# EAGLE design Loco-Speedometer (EAGLE 9.7.0)

## Sheet 1 of 2
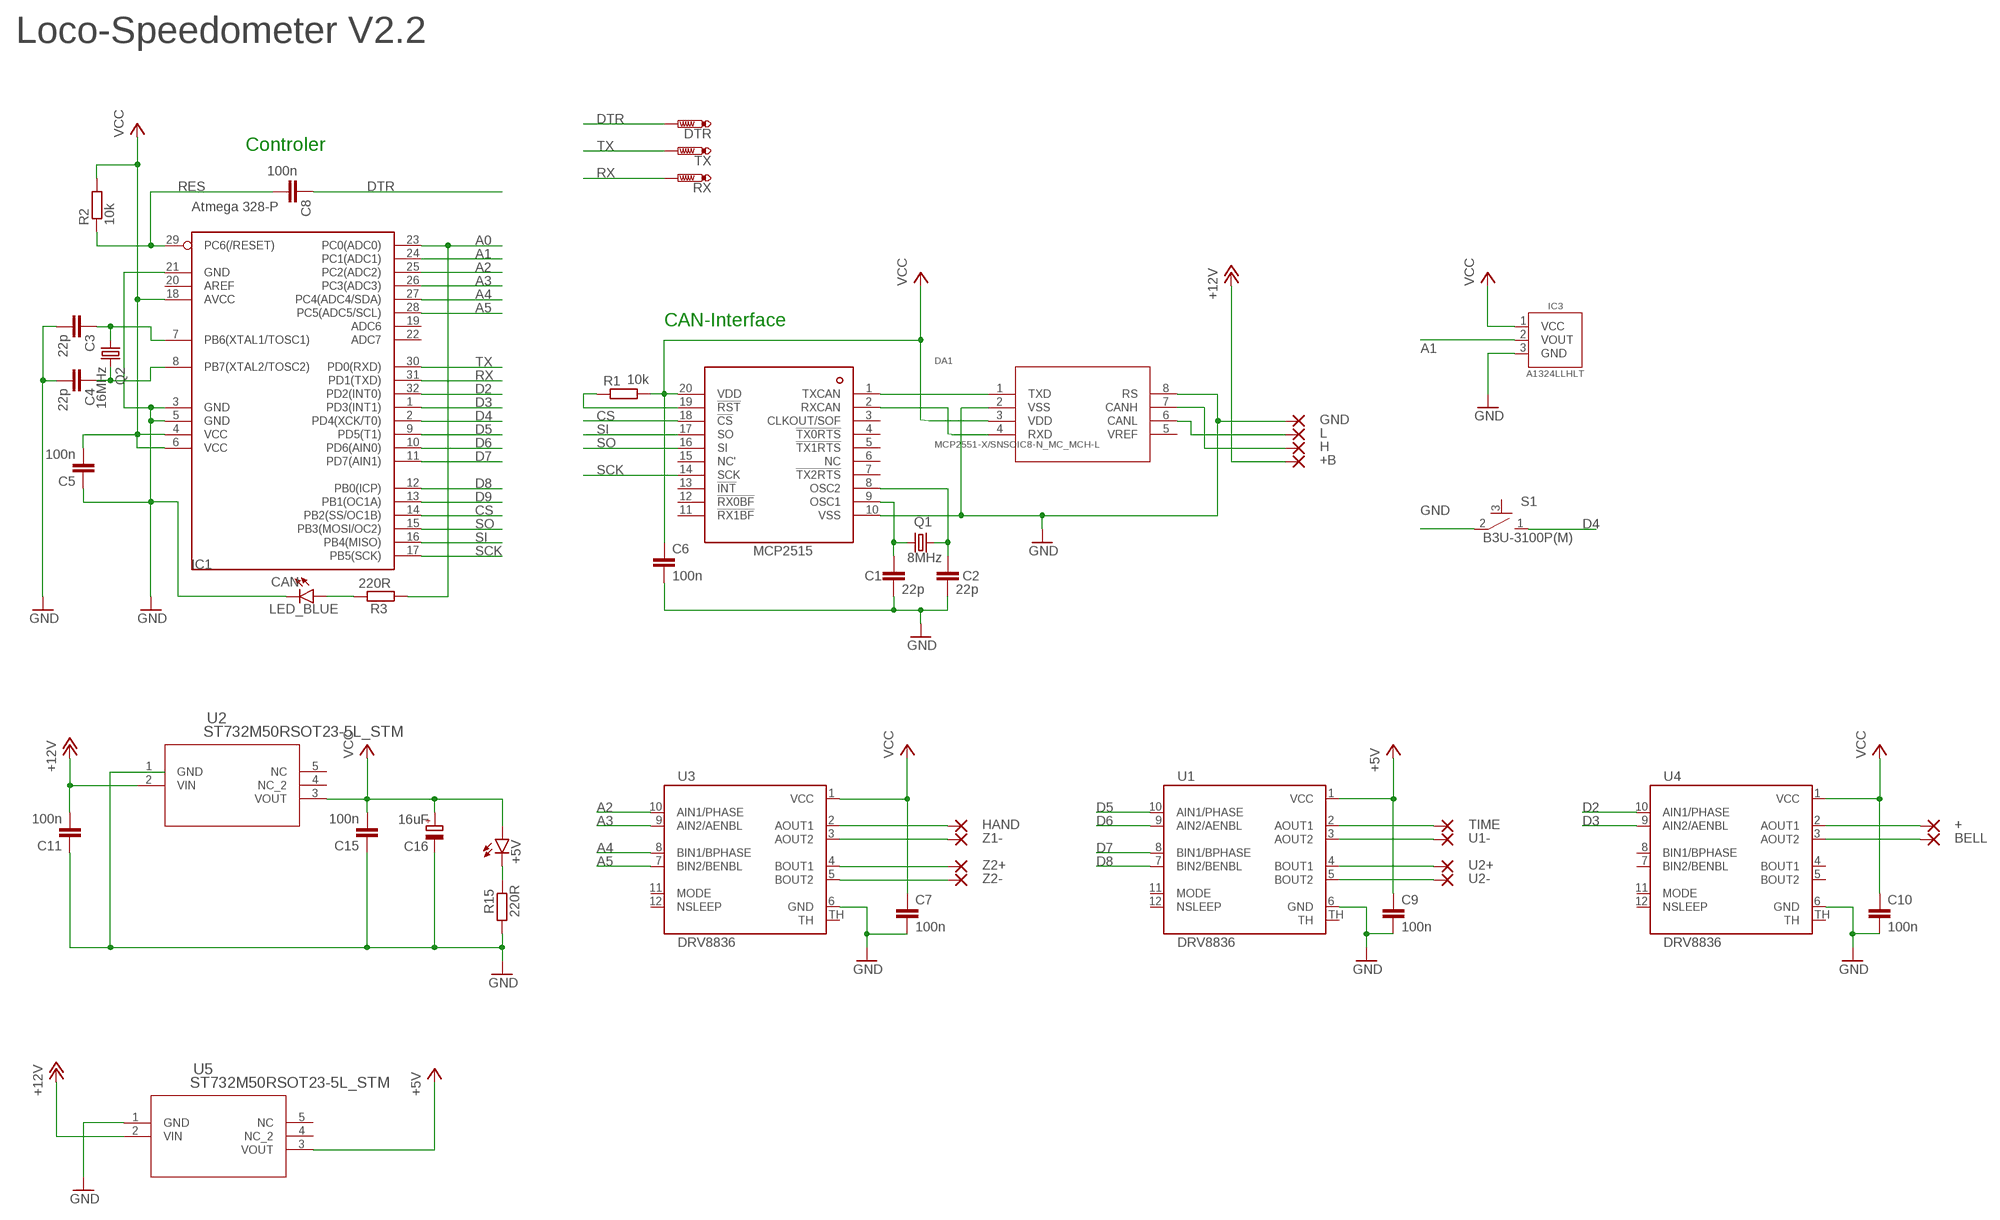
[diagram p0: schematic, sheet 1]

### Parts
+  SMD1  [SMD1,27-1,90]
+5V  LEDCHIP-LED0603  [CHIP-LED0603]
+B  SMD1  [SMD1,27-1,90]
BELL  SMD1  [SMD1,27-1,90]
C1  22p  C-EUC0402K  [C0402K]
C2  22p  C-EUC0402K  [C0402K]
C3  22p  C-EUC0402K  [C0402K]
C4  22p  C-EUC0402K  [C0402K]
C5  100n  C-EUC0402K  [C0402K]
C6  100n  C-EUC0402K  [C0402K]
C7  100n  C-EUC0402K  [C0402K]
C8  100n  C-EUC0402K  [C0402K]
C9  100n  C-EUC0402K  [C0402K]
C10  100n  C-EUC0402K  [C0402K]
C11  100n  C-EUC0402K  [C0402K]
C15  100n  C-EUC0402K  [C0402K]
C16  16uF  CPOL-EUA/3216-18W  [A/3216-18W]
CAN  LED_BLUE  LED_CHIP_BLUE-1608  [LEDC1608X39N_B]
DA1  MCP2551-X/SNSOIC8-N_MC_MCH-L  [SOIC8-N_MC_MCH-L]
DTR  PTR1B1,27  [B1,27]
GND  SMD1  [SMD1,27-1,90]
H  SMD1  [SMD1,27-1,90]
HAND  SMD1  [SMD1,27-1,90]
IC1  Atmega 328-P  MEGA8  [TQFP32-08]
IC2  MCP2515  [TSSOP20]
IC3  A1324LLHLT  A1324LLHLT-TLH  [SOT95P285X113-3N]
L  SMD1  [SMD1,27-1,90]
Q1  8MHz  KX-9B  [5.0X3.2_2]
Q2  16MHz  KX-9B  [5.0X3.2_2]
R1  10k  R-EU_R0402  [R0402]
R2  10k  R-EU_R0402  [R0402]
R3  220R  R-EU_R0402  [R0402]
R15  220R  R-EU_R0402  [R0402]
RX  PTR1B1,27  [B1,27]
S1  B3U-3100P(M)  B3U-X100B3U-3100P(M)3100P(M)  [B3U-3100P(M)]
TIME  SMD1  [SMD1,27-1,90]
TX  PTR1B1,27  [B1,27]
U1  DRV8836  [12WSON]
U1-  SMD1  [SMD1,27-1,90]
U2  ST732M50RSOT23-5L_STM  [SOT23-5L_STM]
U2+  SMD1  [SMD1,27-1,90]
U2-  SMD1  [SMD1,27-1,90]
U3  DRV8836  [12WSON]
U4  DRV8836  [12WSON]
U5  ST732M50RSOT23-5L_STM  [SOT23-5L_STM]
Z1-  SMD1  [SMD1,27-1,90]
Z2+  SMD1  [SMD1,27-1,90]
Z2-  SMD1  [SMD1,27-1,90]

### Nets
+5V: C9.1 U1.1(VCC) U5.3(VOUT)
+12V: +B.1(P) C11.2 U2.2(VIN) U5.2(VIN)
A0: IC1.23(PC0(ADC0)) R3.1
A1: IC1.24(PC1(ADC1)) IC3.2(VOUT)
A2: IC1.25(PC2(ADC2)) U3.10(AIN1/PHASE)
A3: IC1.26(PC3(ADC3)) U3.9(AIN2/AENBL)
A4: IC1.27(PC4(ADC4/SDA)) U3.8(BIN1/BPHASE)
A5: IC1.28(PC5(ADC5/SCL)) U3.7(BIN2/BENBL)
CAN-H: DA1.7(CANH) H.1(P)
CAN-L: DA1.6(CANL) L.1(P)
CAN-OCC1: C1.1 IC2.9(OSC1) Q1.1
CAN-OCC2: C2.1 IC2.8(OSC2) Q1.2
CS: IC1.14(PB2(SS/OC1B)) IC2.18(!CS)
D2: IC1.32(PD2(INT0)) U4.10(AIN1/PHASE)
D3: IC1.1(PD3(INT1)) U4.9(AIN2/AENBL)
D4: IC1.2(PD4(XCK/T0)) S1.1
D5: IC1.9(PD5(T1)) U1.10(AIN1/PHASE)
D6: IC1.10(PD6(AIN0)) U1.9(AIN2/AENBL)
D7: IC1.11(PD7(AIN1)) U1.8(BIN1/BPHASE)
D8: IC1.12(PB0(ICP)) U1.7(BIN2/BENBL)
D9: IC1.13(PB1(OC1A))
DTR: C8.1 DTR.TP
GND: C1.2 C2.2 C3.2 C4.2 C5.1 C6.2 C7.2 C9.2 C10.2 C11.1 C15.1 C16.- CAN.1(C) DA1.2(VSS) DA1.8(RS) GND.1(P) IC1.3(GND) IC1.5(GND) IC1.21(GND) IC2.10(VSS) IC3.3(GND) R15.1 S1.2 U1.6(GND) U2.1(GND) U3.6(GND) U4.6(GND) U5.1(GND)
N$3: CAN.2(A) R3.2
N$6: IC2.19(!RST) R1.1
N$9: C7.1 U3.1(VCC) ; supply symbol labelled VCC
N$10: C3.1 IC1.7(PB6(XTAL1/TOSC1)) Q2.1
N$11: C4.1 IC1.8(PB7(XTAL2/TOSC2)) Q2.2
N$12: +5V.C R15.2
RES: C8.2 IC1.29(PC6(/RESET)) R2.1
RX: IC1.31(PD1(TXD)) RX.TP
RXCAN: DA1.4(RXD) IC2.2(RXCAN)
SCK: IC1.17(PB5(SCK)) IC2.14(SCK)
SI: IC1.16(PB4(MISO)) IC2.17(SO)
SO: IC1.15(PB3(MOSI/OC2)) IC2.16(SI)
TX: IC1.30(PD0(RXD)) TX.TP
TXCAN: DA1.1(TXD) IC2.1(TXCAN)
U1+: TIME.1(P) U1.2(AOUT1)
U1+1: +.1(P) U4.2(AOUT1)
U1-: U1-.1(P) U1.3(AOUT2)
U1-1: BELL.1(P) U4.3(AOUT2)
U2+: U1.4(BOUT1) U2+.1(P)
U2-: U1.5(BOUT2) U2-.1(P)
VCC: +5V.A C5.2 C6.1 C10.1 C15.2 C16.+ DA1.3(VDD) IC1.4(VCC) IC1.6(VCC) IC1.18(AVCC) IC2.20(VDD) IC3.1(VCC) R1.2 R2.2 U2.3(VOUT) U4.1(VCC)
Z1+: HAND.1(P) U3.2(AOUT1)
Z1-: U3.3(AOUT2) Z1-.1(P)
Z2+: U3.4(BOUT1) Z2+.1(P)
Z2-: U3.5(BOUT2) Z2-.1(P)
Unconnected: DA1.5(VREF) IC1.19(ADC6) IC1.20(AREF) IC1.22(ADC7) IC2.3(CLKOUT/SOF) IC2.4(!TX0RTS) IC2.5(!TX1RTS) IC2.6(NC) IC2.7(!TX2RTS) IC2.11(!RX1BF) IC2.12(!RX0BF) IC2.13(!INT) IC2.15(NC') S1.3 U1.11(MODE) U1.12(NSLEEP) U1.TH U2.4(NC_2) U2.5(NC) U3.11(MODE) U3.12(NSLEEP) U3.TH U4.4(BOUT1) U4.5(BOUT2) U4.7(BIN2/BENBL) U4.8(BIN1/BPHASE) U4.11(MODE) U4.12(NSLEEP) U4.TH U5.4(NC_2) U5.5(NC)

### Notes on the sheet
- Loco-Speedometer V2.2
- Controler
- CAN-Interface

## Sheet 2 of 2

## Library data of the parts
+ +B BELL GND H HAND L TIME U1- U2+ U2- Z1- Z2+ Z2- = wirepad:SMD1: SMD PAD
+5V = led:LED: LED OSRAM: - CHIPLED LG R971, LG N971, LY N971, LG Q971, LY Q971, LO R971, LY R971 LH N974, LH R974 LS Q976, LO Q976, LY Q976 LO Q996 - Hyper CHIPLED LW Q18S LB Q993, LB Q99A, LB R99A - SideLED LS A670, LO A670, LY A670, LG A670, LP A670 LB A673, LV A673, LT A673, LW A673 LH A674 LY A675 LS A676, LA A676, LO A676, LY A676, LW A676 LS A679, LY A679, LG A679 - Hyper Micro SIDELED® LS Y876, LA Y876, LO Y876, LY Y876 LT Y87S - SmartLED LW L88C, LW L88S LB L89C, LB L89S, LG L890 LS L89K, LO L89K, LY L89K LS L896, LA L896, LO L896, LY L896 - TOPLED LS T670, LO T670, LY T670, LG T670, LP T670 LSG T670, LSP T670, LSY T670, LOP T670, LYG T670 LG T671, LOG T671, LSG T671 LB T673, LV T673, LT T673, LW T673 LH T674 LS T676, LA T676, LO T676, LY T676, LB T676, LH T676, LSB T676, LW T676 LB T67C, LV T67C, LT T67C, LS T67K, LO T67K, LY T67K, LW E67C LS E67B, LA E67B, LO E67B, LY E67B, LB E67C, LV E67C, LT E67C LW T67C LS T679, LY T679, LG T679 LS T770, LO T770, LY T770, LG T770, LP T770 LB T773, LV T773, LT T773, LW T773 LH T774 LS E675, LA E675, LY E675, LS T675 LS T776, LA T776, LO T776, LY T776, LB T776 LHGB T686 LT T68C, LB T68C - Hyper Mini TOPLED® LB M676 - Mini TOPLED Santana® LG M470 LS M47K, LO M47K, LY M47K Source: http://www.osram.convergy.de LUXEON: - LUMILED® LXK2-PW12-R00, LXK2-PW12-S00, LXK2-PW14-U00, LXK2-PW14-V00 LXK2-PM12-R00, LXK2-PM12-S00, LXK2-PM14-U00 LXK2-PE12-Q00, LXK2-PE12-R00, LXK2-PE12-S00, LXK2-PE14-T00, LXK2-PE14-U00 LXK2-PB12-K00, LXK2-PB12-L00, LXK2-PB12-M00, LXK2-PB14-N00, LXK2-PB14-P00, LXK2-PB14-Q00 LXK2-PR12-L00, LXK2-PR12-M00, LXK2-PR14-Q00, LXK2-PR14-R00 LXK2-PD12-Q00, LXK2-PD12-R00, LXK2-PD12-S00 LXK2-PH12-R00, LXK2-PH12-S00 LXK2-PL12-P00, LXK2-PL12-Q00, LXK2-PL12-R00 Source: www.luxeon.com KINGBRIGHT: KA-3528ASYC Source: www.kingbright.com
C1-C11 C15 = rcl:C-EU: CAPACITOR, European symbol; SPICEPREFIX: C
C16 = rcl:CPOL-EU: POLARIZED CAPACITOR, European symbol; SPICEPREFIX: C
CAN = Opto-Electronic:LED_CHIP: LED - Generic; CATEGORY: Opto-Electronic; COLOR: Blue; SUB-CATEGORY: LED
DA1 = MCP2551:MCP2551-X/SN; COPYRIGHT: Copyright (C) 2023 Ultra Librarian. All rights reserved.; MANUFACTURER_PART_NUMBER: MCP2551-X/SN; MFR_NAME: Microchip
DTR RX TX = testpad:PTR1: TEST PIN
IC1 = atmel:MEGA8: MICROCONTROLLER 8 Kbytes FLASH, 1 kbytes SRAM, 512 bytes EEPROM, USART, 6-channel 10 bit ADC, 2-channel 8 bit ADC Pin compatible with Atmega48, ATMega88, ATMega168 Source: avr.lbr
IC2 = MCP2515:MCP2515: Microchip Technology’s MCP2515 is a stand-alone Controller Area Network (CAN) controller that implements the CAN specification, version 2.0B. It is capable of transmitting and receiving both standard and extended data and remote frames. The MCP2515 has two acceptance masks and six acceptance filters that are used to filter out unwanted messages, thereby reducing the host MCUs overhead. The MCP2515 interfaces with microcontrollers (MCUs) via an industry standard Serial Peripheral Interface (SPI).
IC3 = Sensor:A1324LLHLT-T: SENSOR HALL EFFECT ANALOG SOT23W; CATEGORY: Sensor; MANUFACTURER: Allegro microsystems; MPN: A1324LLHLT-T; OPERATING_TEMP: -40 to 150 °C; PART_STATUS: Active; ROHS_COMPLIANT: RoHS3 Compliant; SUB-CATEGORY: Magnetic
Q1 Q2 = crystal-geyer_V1_0:KX: Quartz Crystals (MHz) SMD: KX - Serie Model Size l/w/h [mm] Frequency Range Frequency Stability Temp. Range [°C] Load Capacitance AECQ 200 availabel Datasheet KX-4 KX-5 KX-6 KX-7 KX-9A KX-9B KX-12A KX-12B KX-13 KX-20 KX-K KX-KS 1.6/1.2/0.3 2.0/1.6/0.45 2.5/2.0/0.55 3.2/2.5/0.8 5.0/3.2/1.0 5.0/3.2/1.1 6.0/3.5/1.1 6.0/3.5/1.0 7.0/5.0 /1.3 11.6/5.5/1.6 12.3/4.5/4.2 12.3/4.5/3.2 24.0 ~ 80.0 MHz 16.0 ~ 80.0 MHz 12.0 ~ 80.0 MHz 8.0 ~ 60.0 MHz 7,68 ~ 300,0 MHz 8,0 ~ 50,0 MHz 8,0 ~ 150,0 MHz 8,0 ~ 50,0 MHz 6,0 ~ 160,0 MHz 3,579 ~ 25,0 MHz 3,579 ~ 70,0 MHz 3,579 ~ 70,0 MHz ±10 … ±50ppm ±10 … ±50ppm ±10 … ±50ppm ±10 … ±50ppm ±10 … ±50ppm ±10 … ±50ppm ±10 … ±50ppm ±10 … ±50ppm ±10 … ±50ppm ±50ppm ±10 … ±50ppm ±10 … ±50ppm (*) -40°C …+85°C (*) -40°C …+125°C (*) -40°C …+125°C (*) -40°C …+125°C (*) -40°C …+105°C (*) -40°C …+105°C (*) -40°C …+125°C (*) -40°C …+105°C (*) -40°C …+105°C (*) -40°C …+105°C (*) -40°C …+85°C (*) -40°C …+85°C 8, 8…16 8, 8…16 10, 8…16 12, 7…20 16, 10…20 16, 10…20 16, 10…20 16, 12…20 16, 12…20 16, 12…20 16, 12…30 16, 12…30 - yes yes yes - - - - - - - - KX-4.pdf <http://www.geyer-electronic.de/uploads/tx_userartikelfrequenz/GEYER-KX-4.pdf> KX-5.pdf <http://www.geyer-electronic.de/uploads/tx_userartikelfrequenz/GEYER-KX-5.pdf> KX-6.pdf <http://www.geyer-electronic.de/uploads/tx_userartikelfrequenz/GEYER-KX-6.pdf> KX-7.pdf <http://www.geyer-electronic.de/uploads/tx_userartikelfrequenz/GEYER-KX-7.pdf> KX-9A.pdf <http://www.geyer-electronic.de/uploads/tx_userartikelfrequenz/GEYER-KX-9A.pdf> KX-9B.pdf <http://www.geyer-electronic.de/uploads/tx_userartikelfrequenz/GEYER-KX-9B.pdf> KX-12A.pdf <http://www.geyer-electronic.de/uploads/tx_userartikelfrequenz/GEYER-KX-12A.pdf> KX-12B.pdf <http://www.geyer-electronic.de/uploads/tx_userartikelfrequenz/GEYER-KX-12B.pdf> KX-13.pdf <http://www.geyer-electronic.de/uploads/tx_userartikelfrequenz/GEYER-KX-13.pdf> KX-20.pdf <http://www.geyer-electronic.de/uploads/tx_userartikelfrequenz/GEYER-KX-20.pdf> KX-K.pdf <http://www.geyer-electronic.de/uploads/tx_userartikelfrequenz/GEYER-KX-K.pdf> KX-KS.pdf <http://www.geyer-electronic.de/uploads/tx_userartikelfrequenz/GEYER-KX-KS.pdf> <http://www.geyer-electronic.de/fileadmin/template/img/logo-geyer-electronic.png> Details see: http://www.geyer-electronic.de/Frequenz-Produkte.9.0.html Created 2016-06-07, Hans Locher 2016 (C) Geyer Quartz Technology KX4,KX5,KX6,KX7,KX9A,KX9B,KX12A,KX12B,KX13,KX20,KXK,KXKS;1612;2016;2520;3225;5032;6035;7050;11655;12345;1,6x1,2;2,0x1,6;2,5x2,0;3,2x2,5;5,0x3,2;6,0x3,5;7,0x5,0;11,6x5,5;12,3x4,5;12,3x4,5;1.6x1.2;2.0x1.6;2.5x2.0;3.2x2.5;5.0x3.2;6.0x3.5;7.0x5.0;11.6x5.5;12.3x4.5;12.3x4.5;
R1-R3 R15 = rcl:R-EU_: RESISTOR, European symbol; SPICEPREFIX: R
S1 = Switch:B3U-X100: Ultra-small Tactile Switch Contact form : SPST-NO Datasheet <https://omronfs.omron.com/en_US/ecb/products/pdf/en-b3u.pdf>; CATEGORY: SWITCH; DESCRIPTION: Ultra-small Surface-mounting Tactile Switches with High Contact Reliability; MANUFACTURER: OMRON; OPERATING_TEMPERATURE: -25°C to +70°C at 60%RH max; PART_STATUS: ACTIVE; ROHS_COMPLIANCE: RoHS Compliant; SERIES: B3U; TYPE: Tactile
U1 U3 U4 = balto:DRV8836: Dual low voltage H-Bridge IC
U2 U5 = ST732:ST732M50R; COPYRIGHT: Copyright (C) 2023 Ultra Librarian. All rights reserved.; MANUFACTURER_PART_NUMBER: ST732M50R; MFR_NAME: STMicroelectronics

## Board
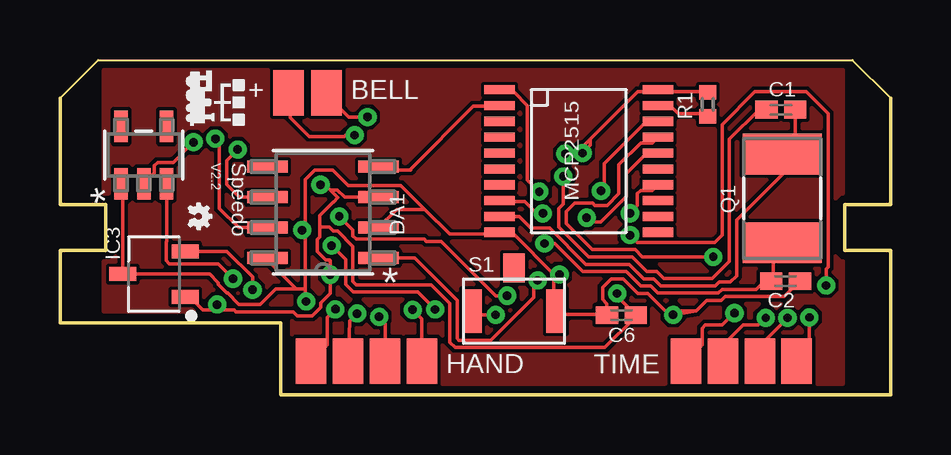
[diagram p1: board, top side]
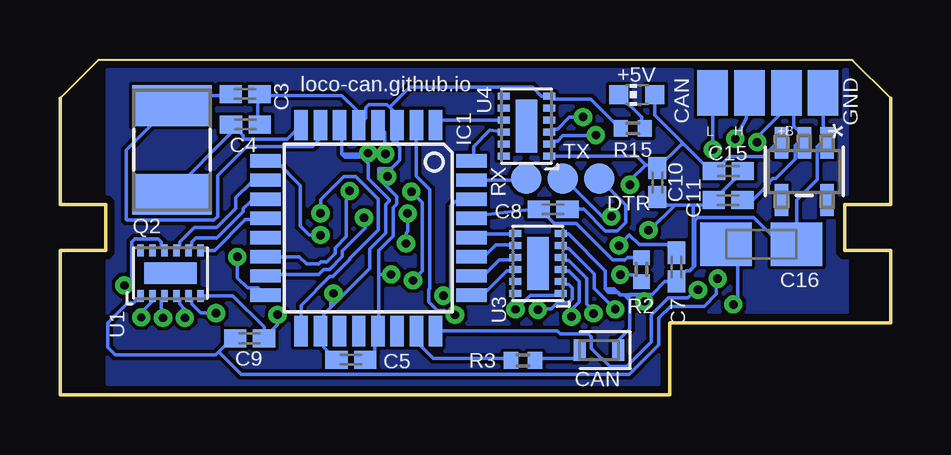
[diagram p2: board, bottom side, seen from below]

Size 34.61 x 13.97 mm. Coordinates in mm from the lower left corner, seen from the top.
Outline: 0,12.38 1.59,13.97 33.02,13.97 34.61,12.38 34.61,7.94 32.7,7.94 32.7,6.03 34.61,6.03 34.61,0 9.21,0 9.21,3.01 0,3.01 0,6.03 1.91,6.03 1.91,7.94 0,7.94 0,12.38
Copper layers (1*16): Top / Bottom
Stack-up Default Layer Stack: Top User Defined 0.035mm / Dielectric-1 User Defined 1.5mm / Bottom User Defined 0.035mm
Design rules "default *": minimum track width 6mil, minimum drill 0.35mm, track to track 6mil, track to pad 6mil, pad to pad 6mil, via to via 6mil, smd to smd 6mil, copper to edge 12mil, drill to drill 6mil, minimum pad ring 10mil, minimum via ring 8mil, stop-mask expansion 4mil, vias tented up to drill 0mil, thermal gap 10mil

### Footprints (pad centres in the part's own frame; a part is rotated, then mirrored left to right if it is on the bottom)
SMD1,27-1,90 = smd 1.27 x 1.905: 1 0,0
CHIP-LED0603 = smd 0.8 x 0.8: A 0,-0.75; C 0,0.75
C0402K = smd 0.925 x 0.74: 1 -0.6,0; 2 0.6,0
A/3216-18W = smd 2.15 x 1.8: + 1.475,0; - -1.475,0
LEDC1608X39N_B = smd 0.512 x 0.912: 1 -0.8,0; 2 0.8,0
SOIC8-N_MC_MCH-L = smd 1.676 x 0.508: 1 -2.311,1.905; 2 -2.311,0.635; 3 -2.311,-0.635; 4 -2.311,-1.905; 5 2.311,-1.905; 6 2.311,-0.635; 7 2.311,0.635; 8 2.311,1.905
B1,27 = smd 1.27 x 1.27: TP 0,0
TQFP32-08 = smd 1.27 x 0.559: 1 -4.293,2.8; 2 -4.293,2; 3 -4.293,1.2; 4 -4.293,0.4; 5 -4.293,-0.4; 6 -4.293,-1.2; 7 -4.293,-2; 8 -4.293,-2.8; 17 4.293,-2.8; 18 4.293,-2; 19 4.293,-1.2; 20 4.293,-0.4; 21 4.293,0.4; 22 4.293,1.2; 23 4.293,2; 24 4.293,2.8 | smd 0.559 x 1.27: 9 -2.8,-4.293; 10 -2,-4.293; 11 -1.2,-4.293; 12 -0.4,-4.293; 13 0.4,-4.293; 14 1.2,-4.293; 15 2,-4.293; 16 2.8,-4.293; 25 2.8,4.293; 26 2,4.293; 27 1.2,4.293; 28 0.4,4.293; 29 -0.4,4.293; 30 -1.2,4.293; 31 -2,4.293; 32 -2.8,4.293
TSSOP20 = smd 1.27 x 0.381: 1 -3.302,2.642; 2 -3.302,1.981; 3 -3.302,1.321; 4 -3.302,0.66; 5 -3.302,0; 6 -3.302,-0.66; 7 -3.302,-1.321; 8 -3.302,-1.981; 9 -3.302,-2.642; 10 -3.302,-3.302; 11 3.302,-3.302; 12 3.302,-2.642; 13 3.302,-1.981; 14 3.302,-1.321; 15 3.302,-0.66; 16 3.302,0; 17 3.302,0.66; 18 3.302,1.321; 19 3.302,1.981; 20 3.302,2.642
SOT95P285X113-3N = smd 1.12 x 0.589: 1 -1.3,0.95; 2 -1.3,-0.95; 3 1.3,0
5.0X3.2_2 = smd 1.7 x 3.3: 1 -1.85,0; 2 1.85,0
R0402 = smd 0.6 x 0.7: 1 -0.5,0; 2 0.5,0
B3U-3100P(M) = smd 0.8 x 1.8: 1 1.75,0; 2 -1.75,0 | smd 0.9 x 1.2: 3 0,-1.8
12WSON = smd 0.28 x 0.5: 1 -1.25,-0.95; 2 -0.75,-0.95; 3 -0.25,-0.95; 4 0.25,-0.95; 5 0.75,-0.95; 6 1.25,-0.95; 7 1.25,0.95; 8 0.75,0.95; 9 0.25,0.95; 10 -0.25,0.95; 11 -0.75,0.95; 12 -1.25,0.95 | smd 2.2 x 0.9: TH 0,0
SOT23-5L_STM = smd 1.321 x 0.559: 1 -1.194,0.95; 2 -1.194,0; 3 -1.194,-0.95; 4 1.194,-0.95; 5 1.194,0.95

### Placement (x,y rotation side)
+  9.53,12.6 0 top
+5V  10.57,12.52 90 bottom
+B  4.34,12.6 0 bottom
BELL  11.11,12.6 0 top
C1  30.03,11.89 180 top
C2  30.23,4.74 0 top
C3  26.9,12.55 0 bottom
C4  26.88,11.28 0 bottom
C5  22.49,1.46 180 bottom
C6  23.39,3.33 180 top
C7  8.92,5.33 270 bottom
C8  14.06,7.75 180 bottom
C9  26.71,2.36 0 bottom
C10  9.72,8.85 270 bottom
C11  6.77,8.12 0 bottom
C15  6.76,9.33 180 bottom
C16  5.39,6.28 180 bottom
CAN  12.15,1.87 180 bottom
DA1  10.96,7.61 180 top
DTR  12.14,9.03 0 bottom
GND  2.81,12.6 0 bottom
H  5.88,12.6 0 bottom
HAND  15.07,1.41 0 top
IC1  21.76,6.96 270 bottom
IC2  21.62,10.08 0 top
IC3  3.91,5.04 180 top
L  7.42,12.6 0 bottom
Q1  30.1,8.2 270 top
Q2  29.94,10.22 270 bottom
R1  26.99,12.12 90 top
R2  10.38,5.23 270 bottom
R3  15.31,1.44 0 bottom
R15  10.74,11.11 0 bottom
RX  15.19,9.03 0 bottom
S1  18.92,3.49 180 top
TIME  30.7,1.41 0 top
TX  13.67,9.03 0 bottom
U1  30,5.08 0 bottom
U1-  29.16,1.41 0 top
U2  3.59,9.32 270 bottom
U2+  27.62,1.41 0 top
U2-  26.09,1.41 0 top
U3  14.7,5.48 90 bottom
U4  15.17,11.21 90 bottom
U5  3.49,10 90 top
Z1-  13.54,1.41 0 top
Z2+  12,1.41 0 top
Z2-  10.46,1.41 0 top

### Tracks (layer width: path | path; a pad name or v marks a point on that pad's centre or on a via)
+5V  (via drill 0.35)
  Top 0.152: U5.3 4.44,6.39 4.42,6.37 4.42,5.6 4.56,5.46 6.59,5.46 v7.21,4.85
  Bottom 0.152: 27.99,1.79 28.11,1.67 32.31,1.67 32.61,1.98 32.61,3 31.78,3.84 31.55,3.84 U1.1 | 27.99,1.79 27.76,2.02 C9.1 | 27.99,1.79 27.06,0.86 10.88,0.86 9.66,2.08 9.66,3.2 9.17,3.7 7.77,3.7 7.26,4.21 7.26,4.8 v7.21,4.85
+12V  (via drill 0.35)
  Top 0.152: U5.2 3.93,9.25 3.93,9.56 4.07,9.7 4.72,9.7 v5.56,10.54
  Bottom 0.152: C11.2 5.75,8.12 5.05,8.82 5.05,8.88 4.92,9.02 4.78,9.02 3.96,9.83 3.96,10.4 3.59,10.77 | U2.2 3.59,10.77 | 3.59,10.77 4.03,11.21 4.03,12.24 +B.1 4.39,11.93 5.56,10.76 v5.56,10.54
A0
  Bottom 0.152: R3.1 15.85,1.52 19.05,1.52 19.66,2.13 19.66,2.58 IC1.23
A1  (via drill 0.35)
  Top 0.152: IC3.2 6.95,5.99 8.02,4.92 v8.02,4.38
  Bottom 0.152: IC1.24 13.88,2.67 13.77,2.55 12.6,2.55 12.46,2.42 12.46,1.95 11.7,1.18 11,1.18 9.97,2.21 9.97,3.33 9.26,4.04 8.46,4.04 8.11,4.39 8.09,4.38 v8.02,4.38
A2
  Bottom 0.152: U3.10 15.7,5.18 16,5.18 16.92,4.26 17.37,4.26 IC1.25
A3
  Bottom 0.152: U3.9 15.7,5.63 16.31,5.63 16.92,5.02 17.37,5.02 IC1.26
A4
  Bottom 0.152: U3.8 15.7,6.24 16.46,6.24 16.92,5.79 17.37,5.79 IC1.27
A5
  Bottom 0.152: U3.7 15.7,6.7 17.37,6.7 IC1.28
CAN-H  (via drill 0.35)
  Top 0.152: DA1.7 7.44,6.98 6.64,7.78 6.64,10.76 v6.47,10.69
  Bottom 0.152: H.1 6.02,11.53 v6.47,10.69
CAN-L  (via drill 0.35)
  Top 0.152: DA1.6 7.48,8.25 6.95,8.78 6.95,9.78 v7.4,10.23
  Bottom 0.152: v7.4,10.23 7.4,12.4 L.1
CAN-OCC1
  Top 0.152: C1.1 30.63,10.51 30.18,10.05 Q1.1 30.1,9.19 28.19,7.28 28.19,4.96 27.94,4.71 27.46,4.71 27.3,4.55 25.03,4.55 24.73,4.84 24.32,4.84 23.71,5.45 21.91,5.45 20.4,6.96 19.62,6.96 19.14,7.44 IC2.9
CAN-OCC2  (via drill 0.35)
  Top 0.152: 29.72,5.11 29.72,5.94 30.02,6.24 Q1.2 | 29.72,5.11 29.72,4.74 C2.1 | 29.72,5.11 29.02,4.4 27.59,4.4 27.43,4.24 24.9,4.24 24.61,4.54 24.19,4.54 23.59,5.14 21.79,5.14 20.61,6.32 v20.19,6.32 | IC2.8 18.34,8.07 19.36,8.07 19.87,7.57 v20.12,7.57
  Bottom 0.152: v20.19,6.32 20.19,6.74 20.12,6.81 v20.12,7.57
CS  (via drill 0.35)
  Top 0.152: IC2.18 24.43,11.4 22.67,9.65 22.67,8.64 v22.54,8.51
  Bottom 0.152: IC1.14 24.63,5.76 24.33,5.45 23.82,5.45 23.74,5.54 23.5,5.54 23.14,5.9 23.14,6.13 22.67,6.6 22.67,8.12 22.54,8.26 v22.54,8.51
D2
  Bottom 0.152: U4.10 16.69,11.04 17.37,10.36 17.37,9.9 IC1.32
D3
  Bottom 0.152: IC1.1 18.9,11.27 18.71,11.46 U4.9
D4  (via drill 0.35)
  Top 0.152: v18.15,3.33 17.33,3.33 S1.1
  Bottom 0.152: IC1.2 19.76,9.12 19.21,8.57 19.21,4.42 19.24,4.39 19.24,3.89 18.89,3.53 18.59,3.53 18.39,3.33 v18.15,3.33
D5  (via drill 0.35)
  Top 0.152: v31.92,4.57 31.92,5.25 32,5.33 32,11.73 31.09,12.64 28.96,12.64 27.58,11.27 27.58,6.66 27.29,6.36 24.05,6.36 v23.75,6.66
  Bottom 0.152: IC1.9 25.91,9.75 25.6,9.75 24.6,8.74 24.6,7.04 24.22,6.66 v23.75,6.66 | U1.10 30.39,6.16 30.39,6.37 30.52,6.51 31.49,6.51 31.62,6.37 31.62,4.87 v31.92,4.57
D6
  Bottom 0.152: IC1.10 26.06,8.83 26.67,8.83 27.28,8.22 27.28,7.78 28.07,6.98 29.02,6.98 29.62,6.37 29.62,6.16 U1.9
D7
  Bottom 0.152: IC1.11 26.06,8.07 26.67,8.07 26.98,7.77 26.98,7.65 28.08,6.55 28.95,6.55 29.12,6.37 29.12,6.16 U1.8
D8
  Bottom 0.152: IC1.12 26.06,7.31 26.89,7.31 28.16,6.03 U1.7
DTR
  Bottom 0.152: C8.1 12.79,7.75 11.89,6.84 11.38,6.84 11.03,7.19 11.03,7.91 DTR.TP
GND  (via drill 0.35)
  Top 0.152: C1.2 29.41,11.88 29.11,11.88 27.89,10.66 27.89,5.57 27.18,4.85 25.16,4.85 24.86,5.15 24.44,5.15 23.84,5.75 22.04,5.75 20.78,7.01 20.78,7.77 20.97,7.95 v20.97,9.11 | 9.84,4.41 10.21,4.41 | 26.52,3.5 v25.55,3.34 | 20.57,5.02 18.9,6.7 18.44,6.7 IC2.10 18.29,6.7 16.23,6.7 15.2,7.74 | 20.57,5.02 20.57,3.5 S1.2 20.73,3.35 22.71,3.35 C6.2 22.79,3.79 22.61,3.98 22.61,4.48 22.96,4.84 23.46,4.84 24.07,4.23 24.48,4.23 25.22,3.5 26.52,3.5 | C2.2 30.19,4.1 27.71,4.1 27.55,3.94 26.96,3.94 26.52,3.5 | v20.81,5.02 20.57,5.02 | 9.84,4.41 8.91,5.35 8.65,5.62 DA1.8 | 10.21,6.75 10.21,8.97 10.6,9.37 11.37,9.37 12.01,8.73 14.2,8.73 15.2,7.74 | 10.21,4.41 10.21,6.75 | 10.21,6.75 v10.09,6.87 | DA1.2 14.03,7.74 15.2,7.74 | v10.26,3.9 10.21,3.94 10.21,4.41 | U5.1 2.61,8.74 IC3.3 6.24,5.04 6.6,4.67 6.6,4.6 6.96,4.24 6.98,4.24 7.45,3.77 8.35,3.77 8.99,4.41 9.84,4.41
  Bottom 0.152: R15.1 11.28,11.12 12.49,12.33 14.09,12.33 U4.6 14.55,12.46 14.92,12.83 20.03,12.83 20.87,12 | 8.98,7.92 9.3,7.92 9.6,8.22 C10.2 | 8.98,7.92 8.23,7.92 | 8.38,5.18 8.53,5.18 8.84,4.87 C7.2 9.4,4.73 9.94,4.2 10.88,4.2 10.93,4.15 10.88,4.1 11,4.1 | 8.38,5.18 8.23,5.33 8.23,7.92 | C5.1 21.79,1.52 21.49,1.82 21.49,2.58 IC1.21 21.34,2.74 21.34,5.02 | C4.2 26.36,11.42 26.36,12.49 C3.2 26.21,12.49 22.86,12.49 22.25,11.88 22.25,11.27 IC1.5 21.87,11.54 21.87,11.98 21.73,12.11 20.99,12.11 20.87,12 | 11.89,4.41 11.89,5.18 13.41,6.7 13.72,6.7 U3.6 | CAN.1 11.43,1.99 11.43,2.18 10.87,2.75 10.87,3.94 11,4.07 11,4.1 | 11.89,4.41 11.76,4.28 11.34,4.28 11.24,4.18 | v25.55,3.34 25.55,2.92 C9.2 26.11,2.83 27.4,4.13 U1.6 | 8.23,7.92 7.58,7.92 C11.1 C15.1 | 8.38,5.18 8.17,5.38 8.17,7.27 8.03,7.41 5.69,7.41 4.57,6.28 C16.- 3.91,8.12 3.05,8.99 3.05,10.36 2.64,10.77 | 21.3,9.44 v20.97,9.11 | 20.56,10.42 20.45,10.3 20.45,9.8 20.8,9.45 | 20.56,10.42 IC1.3 | 21.34,9.44 21.3,9.44 | 21.3,9.44 20.8,9.44 20.8,9.45 | 20.56,10.42 20.75,10.61 20.75,11.88 20.87,12 | 20.8,9.45 21.33,9.45 21.34,9.44 | 21.34,5.02 21.34,6.03 20.73,6.63 20.73,7.82 20.58,7.97 20.58,8.26 21.34,9.02 21.34,9.44 | v20.81,5.02 21.34,5.02 | 8.98,7.92 10.03,6.87 v10.09,6.87 | 11.89,4.41 11.52,4.41 11.29,4.18 11.24,4.18 | 11.24,4.18 11.2,4.18 | 11.2,4.18 10.54,4.18 v10.26,3.9 | U2.1 2.64,10.77 | 2.64,10.77 2.81,10.93 GND.1 | 11.2,4.18 11.11,4.18 11.03,4.1 11,4.1
N$1
  pour Top: 1.75,3.05 9.21,3.05 9.21,0 32.7,0 32.7,13.97 1.75,13.97
  pour Bottom: 1.75,13.97 1.75,3.05 9.21,3.05 9.21,0 32.7,0 32.7,13.97
N$3
  Bottom 0.152: R3.2 14.78,1.52 13,1.52 CAN.2
N$6
  Top 0.152: R1.1 26.98,11.73 25.76,11.73 25.45,12.03 24.99,12.03 IC2.19
N$9  (via drill 0.35)
  Top 0.152: v11.32,6.23 11.9,5.65 11.9,4.6 12.21,4.29 14.91,4.29 v15.63,3.56
  Bottom 0.152: C7.1 8.99,5.94 9.32,6.26 10.48,6.26 10.88,6.67 11.32,6.23 v11.32,6.23 | U3.1 13.81,4.17 13.99,4.17 14.01,4.15 15.01,4.15 15.6,3.56 v15.63,3.56
N$10
  Bottom 0.152: C3.1 27.58,12.49 29.57,12.49 29.87,12.19 Q2.1 30.02,12.03 31.85,10.2 31.85,7.31 31.83,7.29 28.2,7.29 28.04,7.45 28.04,9.14 26.82,10.36 24.08,10.36 23.77,10.66 23.77,11.12 IC1.7
N$11
  Bottom 0.152: 27.28,11.12 26.98,10.81 26.98,10.66 25.15,10.66 24.69,11.12 IC1.8 | 27.28,11.12 27.43,11.27 C4.1 27.28,11.12 | 27.28,11.12 30.02,8.38 Q2.2
N$12
  Bottom 0.152: R15.2 10.36,11.12 10.36,11.58 11.28,12.49 +5V.C
RES
  Bottom 0.152: IC1.29 17.37,7.46 14.84,7.75 C8.2 14.62,7.75 14.02,7.15 13.1,7.15 11.57,5.62 11.07,5.62 10.96,5.73 R2.1
RX
  Bottom 0.152: IC1.31 15.2,8.96 RX.TP
RXCAN
  Top 0.152: IC2.2 18.29,12.03 17.22,12.03 14.61,9.42 14.61,9.37 13.44,9.37 DA1.4
SCK  (via drill 0.35)
  Top 0.152: IC2.14 24.68,8.52 24.19,8.52 24.05,8.39 24.05,7.9 23.75,7.6 v23.75,7.57
  Bottom 0.152: IC1.17 24.56,3.74 23.37,4.93 23.25,4.93 22.54,5.64 22.54,5.69 21.34,6.89 21.34,8.16 22.29,9.11 22.79,9.11 23.75,8.16 v23.75,7.57
SI  (via drill 0.35)
  Top 0.152: IC2.17 24.68,10.5 24.19,10.5 23.28,9.6 23.28,8.39 22.79,7.9 22.29,7.9 22.2,8 21.44,8 21.09,7.64 21.09,7.14 22.17,6.06 23.97,6.06 24.27,5.76 v27.22,5.76
  Bottom 0.152: IC1.16 26.34,4.45 26.78,4.45 27.22,4.89 v27.22,5.76
SO  (via drill 0.35)
  Top 0.152: IC2.16 24.84,10.05 24.4,10.05 23.59,9.24 23.59,8.26 22.54,7.21 22.3,7.21 22.12,7.39 v21.94,7.39
  Bottom 0.152: IC1.15 25.91,5.02 23.82,5.02 23.61,5.24 23.37,5.24 22.84,5.77 22.84,6.01 21.89,6.96 21.89,7.33 v21.94,7.39
TX  (via drill 0.35)
  Top 0.152: v18.63,4.14 18.15,4.14 15.89,6.39 15.27,6.39 15.17,6.5 12.34,6.5 12.2,6.63 12.2,6.88 v11.63,7.45
  Bottom 0.152: IC1.30 17.53,8.07 18.14,8.07 18.33,7.88 18.33,4.44 v18.63,4.14 | v11.63,7.45 12.01,7.45 13.59,9.03 TX.TP
TXCAN  (via drill 0.35)
  Top 0.152: IC2.1 18.44,12.64 18.9,12.64 19.48,12.06 19.48,8.97 v19.97,8.48 | v19.9,4.77 19.74,4.61 19.74,4.07 17.95,2.28 16.61,2.28 16.54,2.35 16.54,3.94 14.77,5.71 DA1.1
  Bottom 0.152: v19.97,8.48 19.51,8.02 19.51,5.16 v19.9,4.77
U1+  (via drill 0.35)
  Top 0.152: TIME.1 30.94,1.52 31.21,1.79 31.21,3.22 v31.22,3.23
  Bottom 0.152: U1.2 30.79,4.1 30.79,3.89 31.22,3.45 v31.22,3.23
U1+1  (via drill 0.35)
  Top 0.152: +.1 9.6,12.49 9.6,11.56 10.38,10.78 11.84,10.78 11.9,10.84 v12.28,10.84
  Bottom 0.152: U4.2 14.09,10.59 13.88,10.59 13.65,10.81 12.3,10.81 v12.28,10.84
U1-  (via drill 0.35)
  Top 0.152: v30.31,3.21 29.19,2.09 U1-.1
  Bottom 0.152: U1.3 30.39,4 30.39,3.31 30.31,3.24 v30.31,3.21
U1-1  (via drill 0.35)
  Top 0.152: BELL.1 11.12,12.49 12.03,11.59 v12.81,11.59
  Bottom 0.152: U4.3 14.09,11.09 13.88,11.09 13.39,11.58 12.82,11.58 v12.81,11.59
U2+  (via drill 0.35)
  Top 0.152: v29.41,3.21 29.1,2.91 28.46,2.91 27.62,2.07 U2+.1
  Bottom 0.152: U1.4 29.62,4 29.62,3.79 29.41,3.57 v29.41,3.21
U2-  (via drill 0.35)
  Top 0.152: U2-.1 26.76,2.08 26.76,2.77 26.89,2.91 27.6,2.91 v28.11,3.41
  Bottom 0.152: U1.5 29.12,4 29.12,3.79 28.75,3.41 v28.11,3.41
VCC  (via drill 0.35)
  Top 0.152: 11.27,8.54 11.58,8.22 11.41,8.05 11.38,8.05 10.82,7.49 10.82,7 | R1.2 26.98,12.64 24.99,12.64 IC2.20 24.84,12.64 24.08,12.64 22.1,10.66 | 22.1,10.66 21.49,10.05 v21.05,10.05 | 10.82,7 10.82,7.01 11.21,7.01 11.38,6.84 11.56,6.84 12.2,6.2 12.2,4.72 12.34,4.59 15.46,4.59 16.24,3.81 16.24,2.2 16.46,1.98 22.71,1.98 23.93,3.19 C6.1 23.21,4.11 v23.21,4.23 | 22.1,10.66 22.1,10.42 v21.77,10.09 | 10.82,7 10.82,6.58 10.71,6.48 10.71,5.97 11.07,5.62 11.24,5.62 11.26,5.6 v11.26,5.01 11.26,4.24 10.87,3.84 10.87,3.64 10.51,3.29 9.89,3.29 9.71,3.47 7.33,3.47 7.26,3.53 6.67,3.53 | 11.27,8.54 11.56,8.54 11.86,8.25 DA1.3 | 11.27,8.54 11.05,8.76 v10.86,8.76 | IC3.1 5.4,4.09 5.95,3.53 6.67,3.53 | 6.67,3.53 6.55,3.65 v6.55,3.77
  Bottom 0.152: 10.21,9.6 9.75,9.6 C10.1 8.72,10.45 8.6,10.45 | C5.2 23.16,1.52 23.62,1.98 23.62,2.58 IC1.18 23.62,2.74 23.62,3.35 23.32,3.65 | 22.86,10.05 22.86,11.12 IC1.6 | 8.6,10.45 7.49,9.33 C15.2 7.31,9.33 6.72,9.93 5.31,9.93 4.73,10.52 U2.3 | +5V.A 9.82,11.66 8.6,10.45 | IC1.4 21.07,10.96 21.07,10.52 21.05,10.51 v21.05,10.05 | 22.86,10.05 22.73,9.93 22.04,9.93 21.76,9.65 21.76,9.02 20.88,8.14 20.88,8.1 21.03,7.94 21.03,6.76 21.7,6.09 21.7,5.26 23.32,3.65 | 22.86,10.05 22.1,10.05 22.07,10.09 v21.77,10.09 | v23.21,4.23 23.21,4.1 23.32,3.99 23.32,3.65 | 10.21,9.6 10.57,9.96 U4.1 | v10.86,8.76 10.86,8.95 10.21,9.6 | R2.2 10.66,5.01 v11.26,5.01 | C16.+ 6.38,5.79 6.38,3.94 v6.55,3.77
Z1+  (via drill 0.35)
  Top 0.152: HAND.1 15.07,3.17 v14.69,3.55
  Bottom 0.152: U3.2 13.62,4.6 13.4,4.6 13.27,4.47 13.27,4 13.4,3.86 13.87,3.86 14.15,3.58 14.66,3.58 v14.69,3.55
Z1-  (via drill 0.35)
  Top 0.152: v13.3,3.26 13.56,2.97 Z1-.1
  Bottom 0.152: U3.3 13.72,5.18 13.41,5.18 12.96,4.73 12.96,3.87 13.3,3.54 v13.3,3.26
Z2+  (via drill 0.35)
  Top 0.152: v12.38,3.39 12.06,3.08 Z2+.1
  Bottom 0.152: U3.4 13.62,5.6 13.4,5.6 12.66,4.86 12.66,3.79 12.38,3.51 v12.38,3.39
Z2-  (via drill 0.35)
  Top 0.152: Z2-.1 11.14,2.08 11.14,3.24 v11.47,3.57
  Bottom 0.152: U3.5 13.62,6.1 13.4,6.1 12.35,5.05 12.35,4.45 11.76,3.86 v11.47,3.57

### Text on the board
tNames: V2.2 | Speedo
bNames: loco-can.github.io | CAN